# EAGLE design Codeshelf-0005.v1.r1 (EAGLE 5.11)
MFGN: Pansonic; MFGP: ERJ-2GEJ680X; MFN: Panasonic; NOTES: DNP; PRICE: 0.02
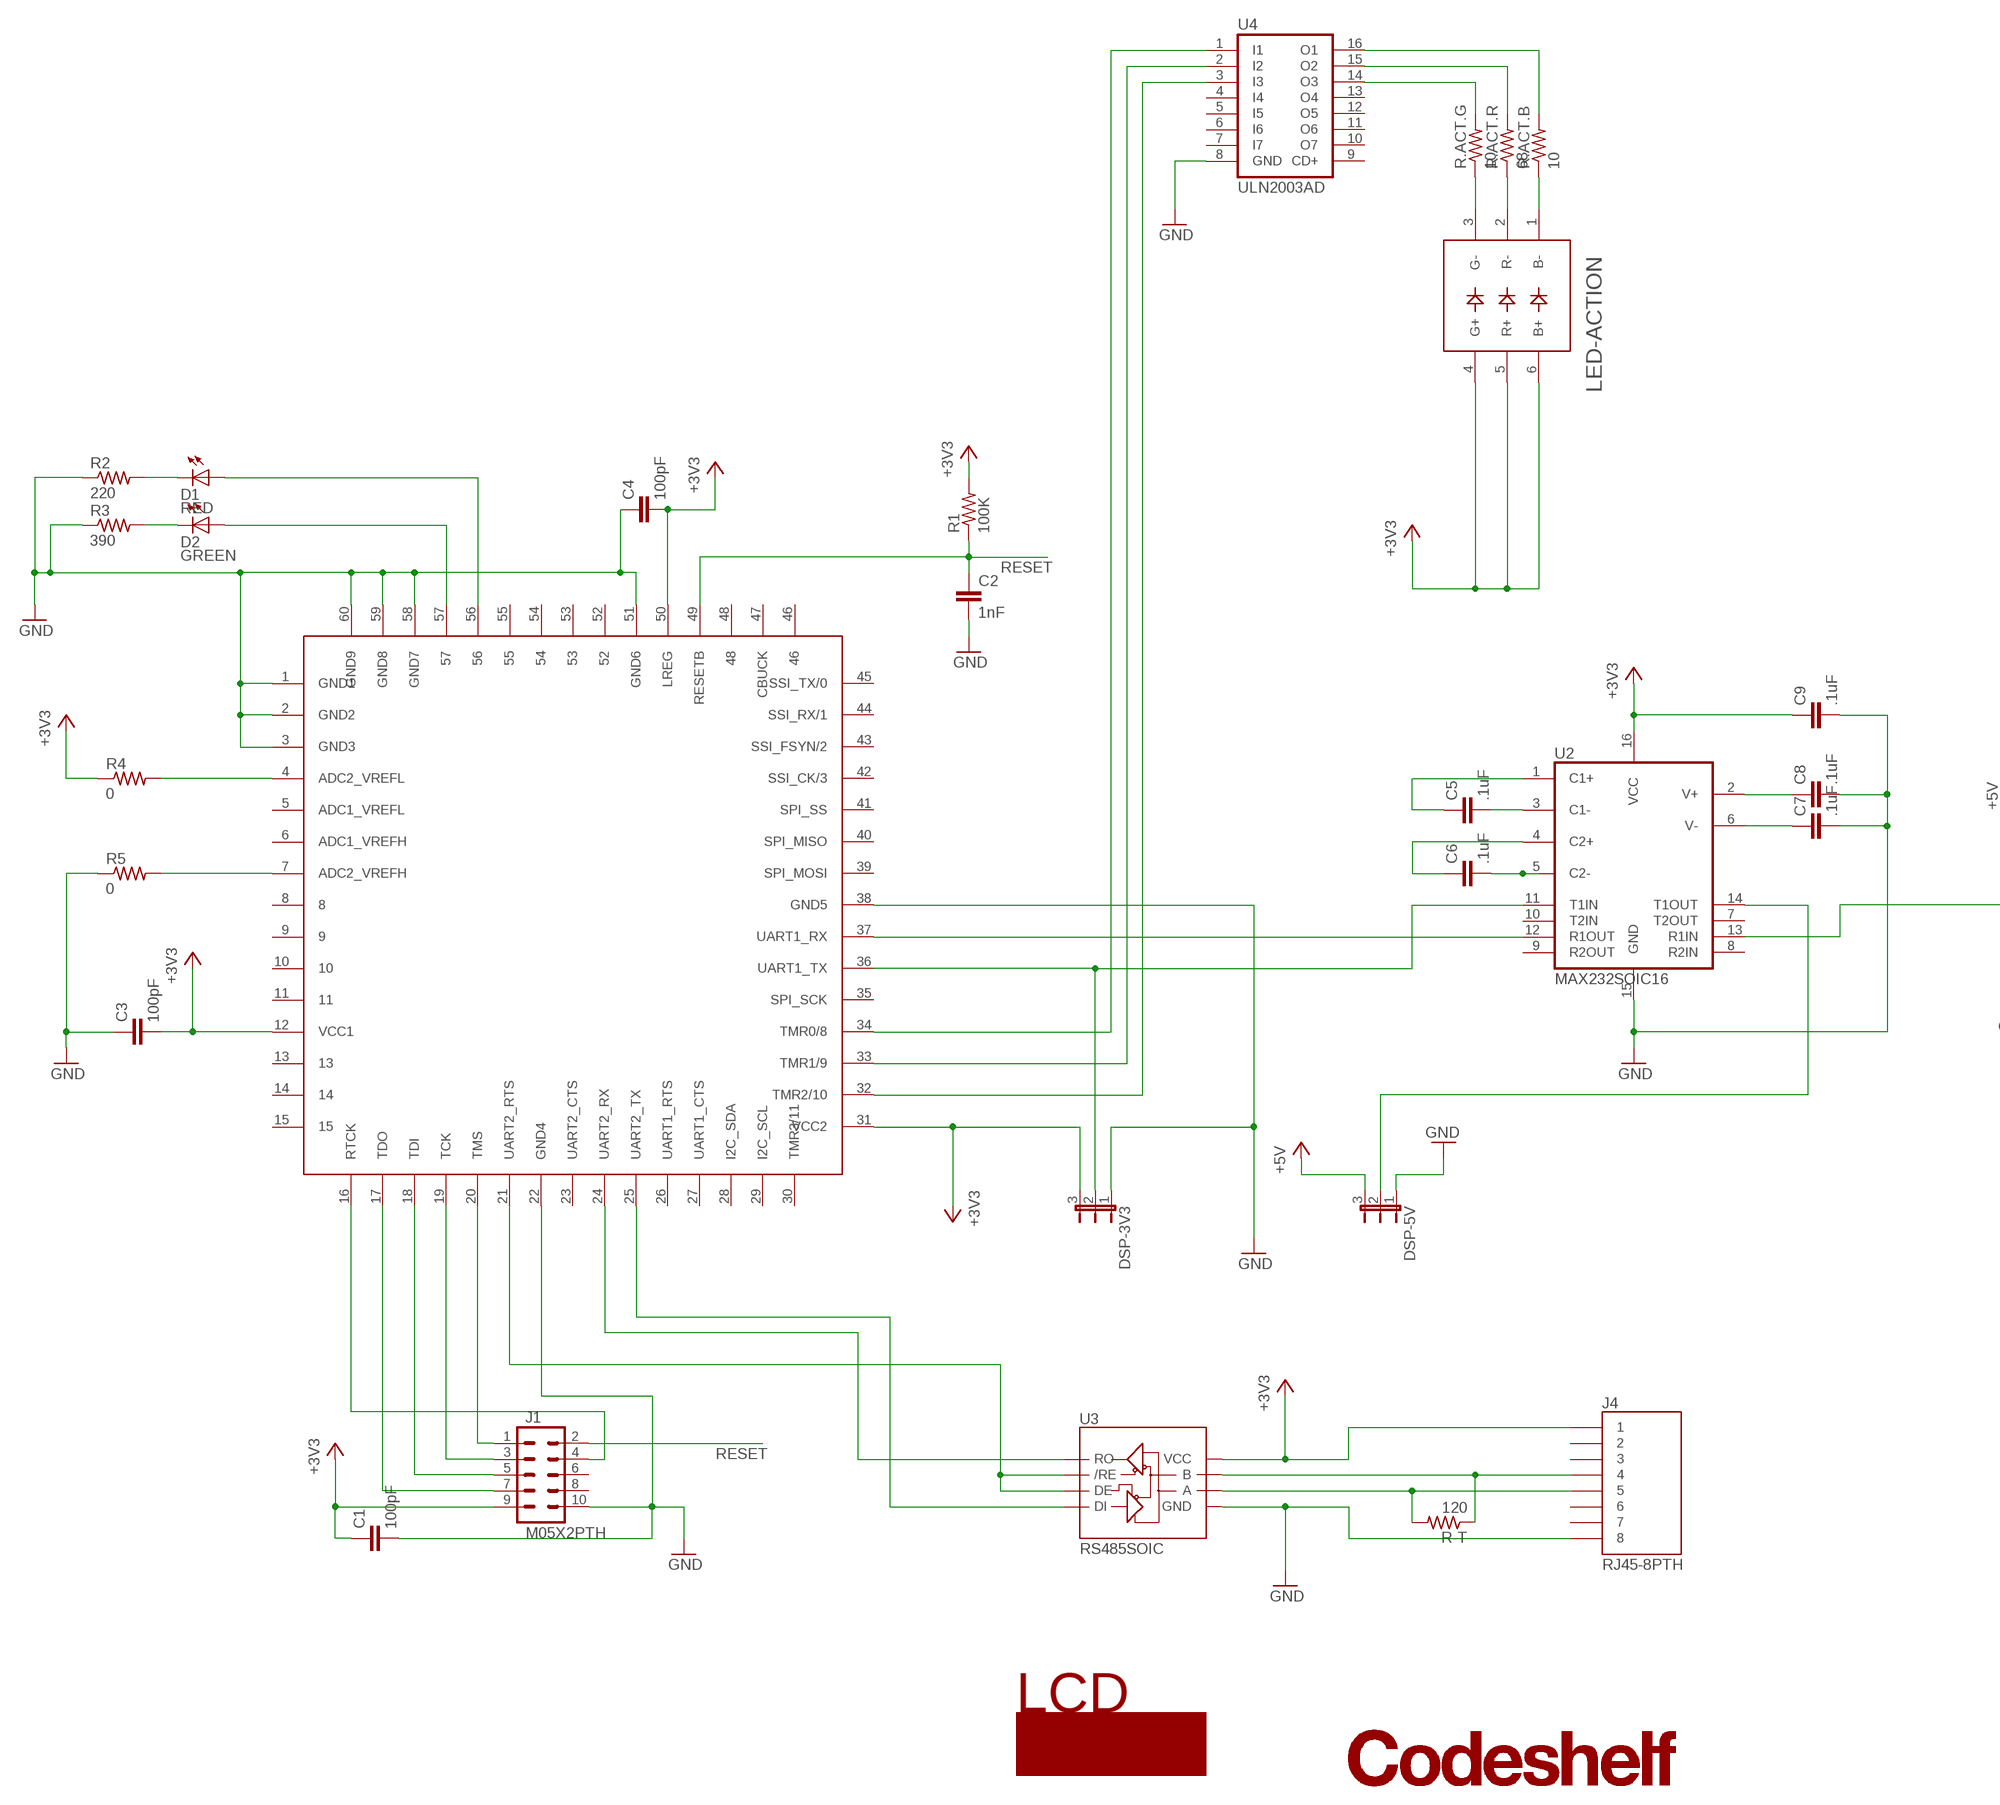
[diagram p0: schematic, sheet 1, part 1 of 2]
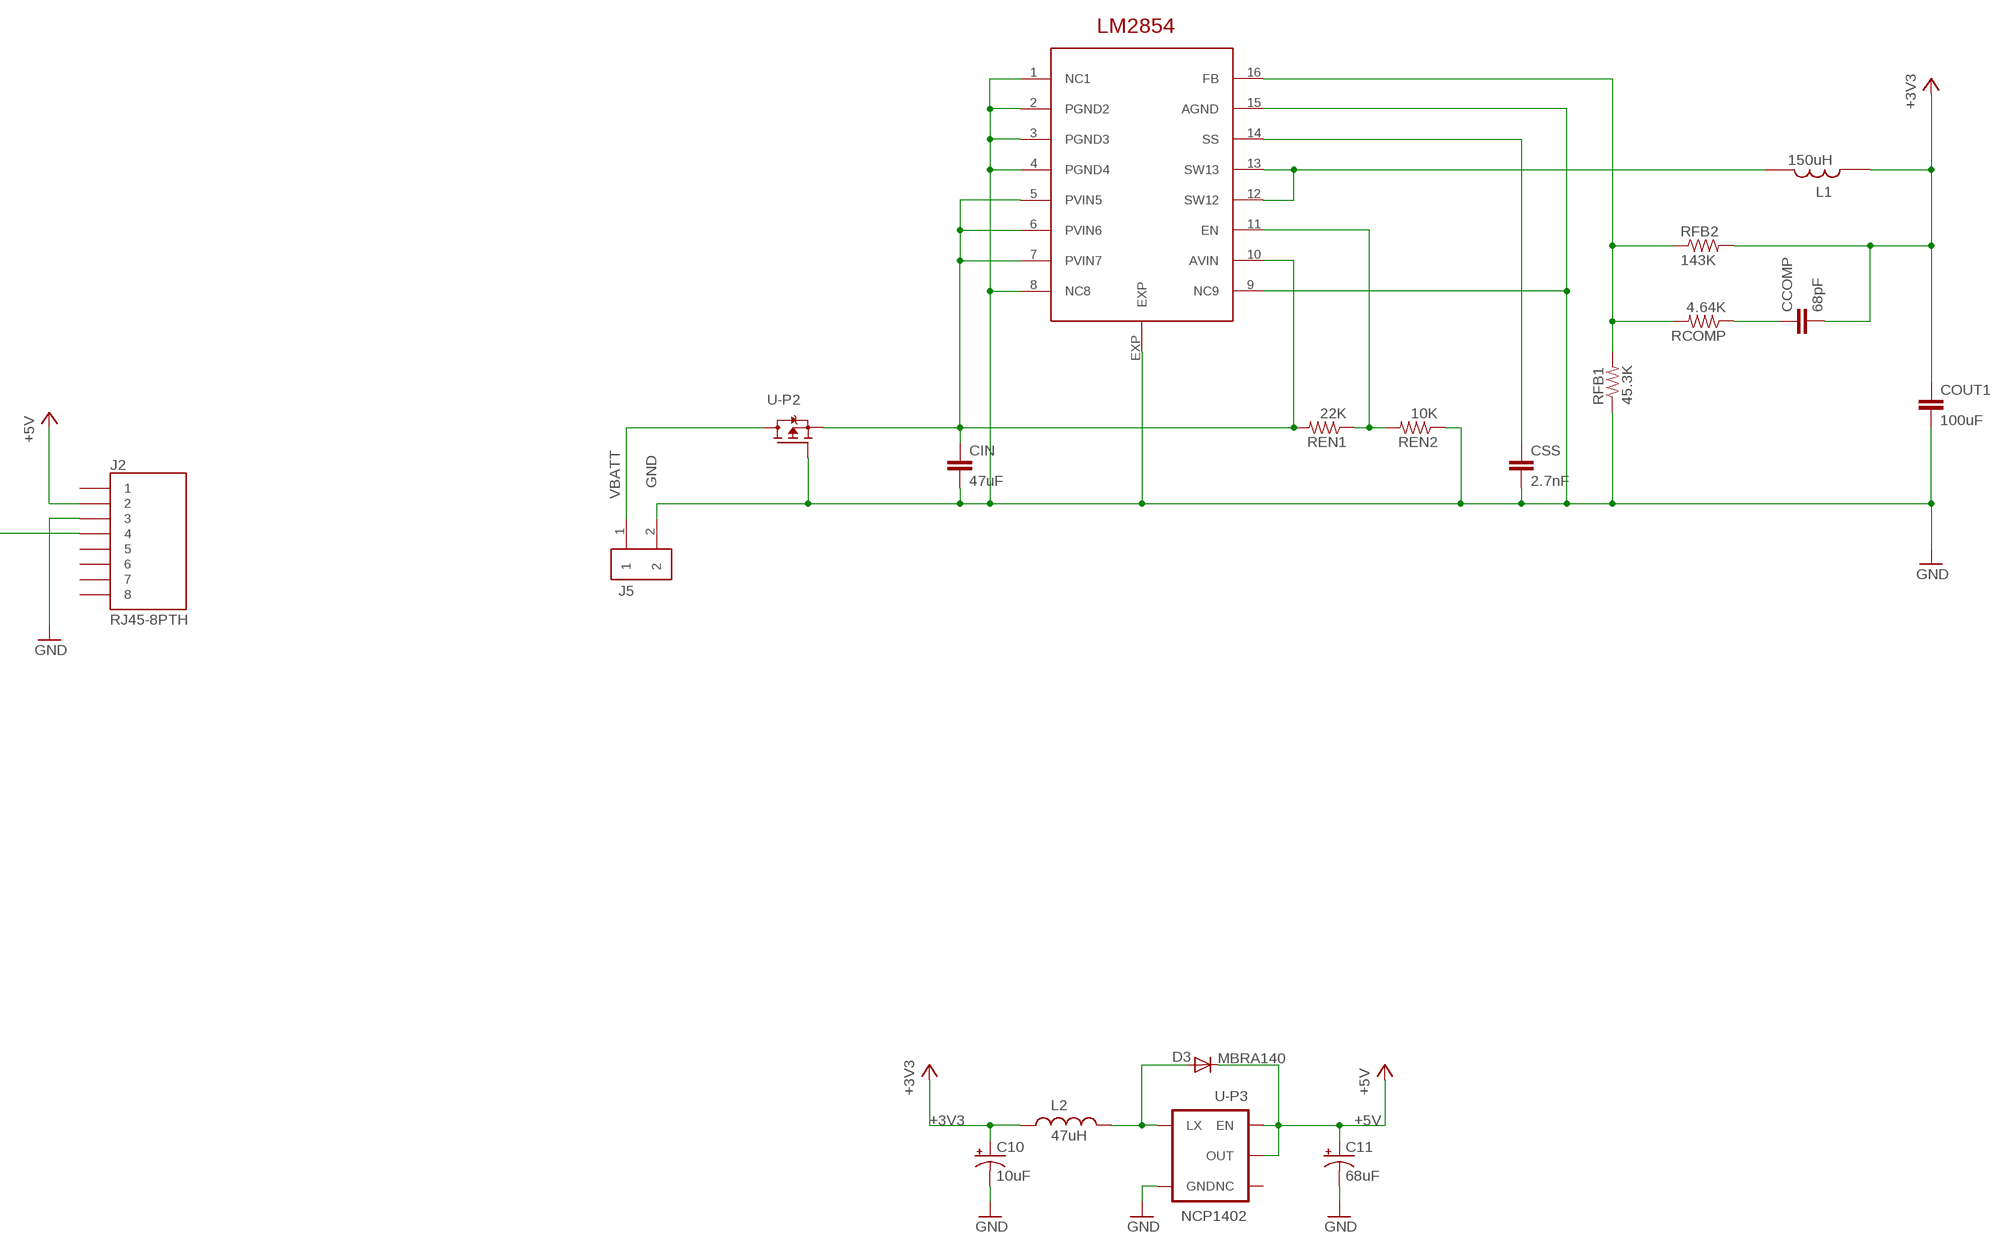
[diagram p1: schematic, sheet 1, part 2 of 2]

## Parts
C1  100pF  RF-C0603  [C0603]
C2  1nF  RF-C0603  [C0603]
C3  100pF  RF-C0603  [C0603]
C4  100pF  RF-C0603  [C0603]
C5  .1uF  RF-C0402  [C0402]
C6  .1uF  RF-C0402  [C0402]
C7  .1uF  RF-C0402  [C0402]
C8  .1uF  RF-C0402  [C0402]
C9  .1uF  RF-C0402  [C0402]
C10  10uF  CAP_POL1206  [EIA3216]
C11  68uF  CAP_POL3528  [EIA3528]
CCOMP  68pF  RF-C0402  [C0402]
CIN  47uF  RF-C1210  [C1210K]
COUT1  100uF  RF-C1210  [C1210K]
CSS  2.7nF  RF-C0805  [C0805]
D1  RED  LEDCHIP-LED0805  [CHIP-LED0805]
D2  GREEN  LEDCHIP-LED0805  [CHIP-LED0805]
D3  MBRA140  DIODESMA  [SMA-DIODE]
DSP-3V3  JUMPER-3PTH  [1X03]
DSP-5V  JUMPER-3PTH  [1X03]
J1  M05X2PTH  [AVR_ICSP]
J2  RJ45-8PTH  [RJ45-8]
J4  RJ45-8PTH  [RJ45-8]
J5  HEADER-2X39357-0002  [MOLEX-39357-0002]
L1  150uH  SLF10165  [SLF10165]
L2  47uH  INDUCTORCR54  [CR54]
LCD  LCD-SPARKFUN  LCD-SPARKFUN20X4  [LCD-20X4-SPARKFUN]
LED-ACTION  LED5060A  [PLCC-6]
LOGO  CODESHELF-LOGO  [CODESHELF-LOGO]
R1  100K  RF-R0402  [RF-R0402]
R2  220  RF-R0402  [RF-R0402]
R3  390  RF-R0402  [RF-R0402]
R4  0  RF-R0402  [RF-R0402]
R5  0  RF-R0402  [RF-R0402]
R-T  120  RF-R0402  [RF-R0402]
R.ACT.B  10  RF-R0402  [RF-R0402]
R.ACT.G  10  RF-R0402  [RF-R0402]
R.ACT.R  68  RF-R0402  [RF-R0402]
RCOMP  4.64K  RF-R0402  [RF-R0402]
REN1  22K  RF-R0402  [RF-R0402]
REN2  10K  RF-R0402  [RF-R0402]
RFB1  45.3K  RF-R0402  [RF-R0402]
RFB2  143K  RF-R0805  [RF-C0805]
U1  ZSFM201-1A  [ZSFM201-1]
U2  MAX232SOIC16  [SO016]
U3  RS485SOIC  [SO08]
U4  ULN2003AD  [SO16]
U-P1  LM2854MH  [HTSSOP16PWP]
U-P2  PCHANNEL-MOSFET-DPAK  [DPAK]
U-P3  NCP1402  V_REG_NCP1400SOT23-5  [SOT23-5]

## Nets
+3V3 [3v3]: C1.1 C3.2 C4.2 C9.1 C10.A(+) CCOMP.2 COUT1.1 DSP-3V3.3 J1.9 J4.1 L1.2 L2.P$1 LED-ACTION.4(G+) LED-ACTION.5(R+) LED-ACTION.6(B+) R1.2 R4.1 RFB2.2 U1.12(VCC1) U1.31(VCC2) U1.50(LREG) U2.16(VCC) U3.8(VCC)
+5V [5V]: C11.A(+) D3.C DSP-5V.3 J2.2 U-P3.1(EN) U-P3.2(OUT)
C1: C5.1 U2.1(C1+)
C2: C6.1 U2.4(C2+)
GND [GND]: C1.2 C2.2 C3.1 C4.1 C7.2 C8.2 C9.2 C10.C(-) C11.C(-) CIN.2 COUT1.2 CSS.2 DSP-3V3.1 DSP-5V.1 J1.10 J2.3 J4.8 J5.2 R2.1 R3.1 R5.1 REN2.1 RFB1.1 U1.1(GND1) U1.2(GND2) U1.3(GND3) U1.22(GND4) U1.38(GND5) U1.51(GND6) U1.58(GND7) U1.59(GND8) U1.60(GND9) U2.15(GND) U3.5(GND) U4.8(GND) U-P1.1(NC1) U-P1.2(PGND2) U-P1.3(PGND3) U-P1.4(PGND4) U-P1.8(NC8) U-P1.9(NC9) U-P1.15(AGND) U-P1.EXP U-P2.1(G) U-P3.4(GND)
N$1: D2.A U1.57
N$2: D1.A U1.56
N$3: D2.C R3.2
N$4: D1.C R2.2
N$5: D3.A L2.P$2 U-P3.5(LX)
N$6: R5.2 U1.7(ADC2_VREFH)
N$7: R4.2 U1.4(ADC2_VREFL)
N$8: C5.2 U2.3(C1-)
N$11: C6.2 U2.5(C2-)
N$12: C7.1 U2.6(V-)
N$15: C8.1 U2.2(V+)
N$17: U1.25(UART2_TX) U3.4(DI)
N$18: U1.24(UART2_RX) U3.1(RO)
N$19: U1.21(UART2_RTS) U3.2(/RE) U3.3(DE)
N$20 [RS485]: J4.4 R-T.1 U3.7(B)
N$21 [RS485]: J4.5 R-T.2 U3.6(A)
N$22: CSS.1 U-P1.14(SS)
N$23: L1.1 U-P1.12(SW12) U-P1.13(SW13)
N$24: RCOMP.2 RFB1.2 RFB2.1 U-P1.16(FB)
N$25: CCOMP.1 RCOMP.1
N$26: REN1.1 REN2.2 U-P1.11(EN)
N$28: R.ACT.R.2 U4.15(O2)
N$30: R.ACT.G.2 U4.14(O3)
N$33: LED-ACTION.1(B-) R.ACT.B.1
N$34: LED-ACTION.2(R-) R.ACT.R.1
N$35: LED-ACTION.3(G-) R.ACT.G.1
N$36: U1.34(TMR0/8) U4.1(I1)
N$37: U1.33(TMR1/9) U4.2(I2)
N$38: R.ACT.B.2 U4.16(O1)
N$39: U1.32(TMR2/10) U4.3(I3)
R1IN: J2.4 U2.13(R1IN)
R1OUT: U1.37(UART1_RX) U2.12(R1OUT)
RESET: C2.1 J1.2 R1.1 U1.49(RESETB)
RTCK: J1.4 U1.16(RTCK)
T1IN: DSP-3V3.2 U1.36(UART1_TX) U2.11(T1IN)
T1OUT: DSP-5V.2 U2.14(T1OUT)
TCK: J1.3 U1.19(TCK)
TDI: J1.5 U1.18(TDI)
TDO: J1.7 U1.17(TDO)
TMS: J1.1 U1.20(TMS)
V-PROT: CIN.1 REN1.2 U-P1.5(PVIN5) U-P1.6(PVIN6) U-P1.7(PVIN7) U-P1.10(AVIN) U-P2.3(S)
VBATT: J5.1 U-P2.4(D)
Unconnected: J1.6 J1.8 J2.1 J2.5 J2.6 J2.7 J2.8 J4.2 J4.3 J4.6 J4.7 U1.5(ADC1_VREFL) U1.6(ADC1_VREFH) U1.8 U1.9 U1.10 U1.11 U1.13 U1.14 U1.15 U1.23(UART2_CTS) U1.26(UART1_RTS) U1.27(UART1_CTS) U1.28(I2C_SDA) U1.29(I2C_SCL) U1.30(TMR3/11) U1.35(SPI_SCK) U1.39(SPI_MOSI) U1.40(SPI_MISO) U1.41(SPI_SS) U1.42(SSI_CK/3) U1.43(SSI_FSYN/2) U1.44(SSI_RX/1) U1.45(SSI_TX/0) U1.46 U1.47(CBUCK) U1.48 U1.52 U1.53 U1.54 U1.55 U2.7(T2OUT) U2.8(R2IN) U2.9(R2OUT) U2.10(T2IN) U4.4(I4) U4.5(I5) U4.6(I6) U4.7(I7) U4.9(CD+) U4.10(O7) U4.11(O6) U4.12(O5) U4.13(O4) U-P3.3(NC)

## Library data of the parts
C1-C9 CCOMP CIN COUT1 CSS = GW-devices:RF-C: RF capacitor pads for FSL reference design
C10 C11 = SparkFun:CAP_POL: Capacitor Polarized These are standard SMD and PTH capacitors. Normally 10uF, 47uF, and 100uF in electrolytic and tantalum varieties. Always verify the external diameter of the through hole cap, it varies with capacity, voltage, and manufacturer. The EIA devices should be standard.
D1 D2 = led:LED: LED OSRAM: - CHIPLED LG R971, LG N971, LY N971, LG Q971, LY Q971, LO R971, LY R971 LH N974, LH R974 LS Q976, LO Q976, LY Q976 LO Q996 - Hyper CHIPLED LW Q18S LB Q993, LB Q99A, LB R99A - SideLED LS A670, LO A670, LY A670, LG A670, LP A670 LB A673, LV A673, LT A673, LW A673 LH A674 LY A675 LS A676, LA A676, LO A676, LY A676, LW A676 LS A679, LY A679, LG A679 - Hyper Micro SIDELED® LS Y876, LA Y876, LO Y876, LY Y876 LT Y87S - SmartLED LW L88C, LW L88S LB L89C, LB L89S, LG L890 LS L89K, LO L89K, LY L89K LS L896, LA L896, LO L896, LY L896 - TOPLED LS T670, LO T670, LY T670, LG T670, LP T670 LSG T670, LSP T670, LSY T670, LOP T670, LYG T670 LG T671, LOG T671, LSG T671 LB T673, LV T673, LT T673, LW T673 LH T674 LS T676, LA T676, LO T676, LY T676, LB T676, LH T676, LSB T676, LW T676 LB T67C, LV T67C, LT T67C, LS T67K, LO T67K, LY T67K, LW E67C LS E67B, LA E67B, LO E67B, LY E67B, LB E67C, LV E67C, LT E67C LW T67C LS T679, LY T679, LG T679 LS T770, LO T770, LY T770, LG T770, LP T770 LB T773, LV T773, LT T773, LW T773 LH T774 LS E675, LA E675, LY E675, LS T675 LS T776, LA T776, LO T776, LY T776, LB T776 LHGB T686 LT T68C, LB T68C - Hyper Mini TOPLED® LB M676 - Mini TOPLED Santana® LG M470 LS M47K, LO M47K, LY M47K Source: http://www.osram.convergy.de LUXEON: - LUMILED® LXK2-PW12-R00, LXK2-PW12-S00, LXK2-PW14-U00, LXK2-PW14-V00 LXK2-PM12-R00, LXK2-PM12-S00, LXK2-PM14-U00 LXK2-PE12-Q00, LXK2-PE12-R00, LXK2-PE12-S00, LXK2-PE14-T00, LXK2-PE14-U00 LXK2-PB12-K00, LXK2-PB12-L00, LXK2-PB12-M00, LXK2-PB14-N00, LXK2-PB14-P00, LXK2-PB14-Q00 LXK2-PR12-L00, LXK2-PR12-M00, LXK2-PR14-Q00, LXK2-PR14-R00 LXK2-PD12-Q00, LXK2-PD12-R00, LXK2-PD12-S00 LXK2-PH12-R00, LXK2-PH12-S00 LXK2-PL12-P00, LXK2-PL12-Q00, LXK2-PL12-R00 Source: www.luxeon.com KINGBRIGHT: KA-3528ASYC Source: www.kingbright.com
D3 = SparkFun:DIODE: Diode These are standard reverse protection diodes and small signal diodes. SMA package can handle up to about 1A. SOD-323 can handle about 200mA. What the SOD-323 package when ordering, there are some mfgs out there that are 5-pin packages.
DSP-3V3 DSP-5V = SparkFun:JUMPER-3
J1 = SparkFun:M05X2: Header 5x2 Standard 10-pin dual row 0.1" header. Commonly used with AVR-ISP. Use with Spark Fun Electronics SKU: PRT-00778
J2 J4 = SparkFun:RJ45-8: RJ45 Jack Simple RJ45, 8-pin connection - connector for common Cat5, Cat5e, and Cat6 Ethernet cables. Footprint not yet proven in production. Connector sku is PRT-00643; Breakout PCB sku is BOB-00716.
J5 = GW-devices:HEADER-2X: 2 position pin header
L1 = GW-devices:SLF10165
L2 = SparkFun:INDUCTOR: Inductors Basic Inductor/Choke - 0603 and 1206. Footprints are not proven and vary greatly between part numbers.
LCD = GW-devices:LCD-SPARKFUN
LED-ACTION = GW-devices:LED5060: PLCC-6 5060 6000mcd RGB LED; PRICE: 0.25
LOGO = GW-devices:CODESHELF-LOGO
R1-R5 R-T R.ACT.B R.ACT.G R.ACT.R RCOMP REN1 REN2 RFB1 RFB2 = GW-devices:RF-R: RF resistor pads for FSL reference design
U1 = GW-devices:ZSFM201-1: The CEL MC13224V
U2 = SparkFun:MAX232: RS232 Transceiver Very common IC. This is generically called 'MAX232', but works with the 3V equivalent MAX3232 generic ICs. Field tested and mother approved. Spark Fun Electronics SKU : COM-00316 (DIP) and COM-00589 (SMD)
U3 = SparkFun:RS485
U4 = uln-udn:ULN2003A: DRIVER ARRAY
U-P1 = GW-devices:LM2854
U-P2 = GW-devices:PCHANNEL-MOSFET
U-P3 = SparkFun:V_REG_NCP1400: Switching step-up voltage regulator NCP1400 switiching regulator takes single cell AA and outputs 100mA at 3.3V or 5V with minimal number of external components.

## Net classes
1 3v3: width 0.6 mm
2 5V: width 0.6 mm
3 +3V3: width 0.6 mm
4 GND: width 0.6 mm
5 RS485: width 0.4 mm

## Board
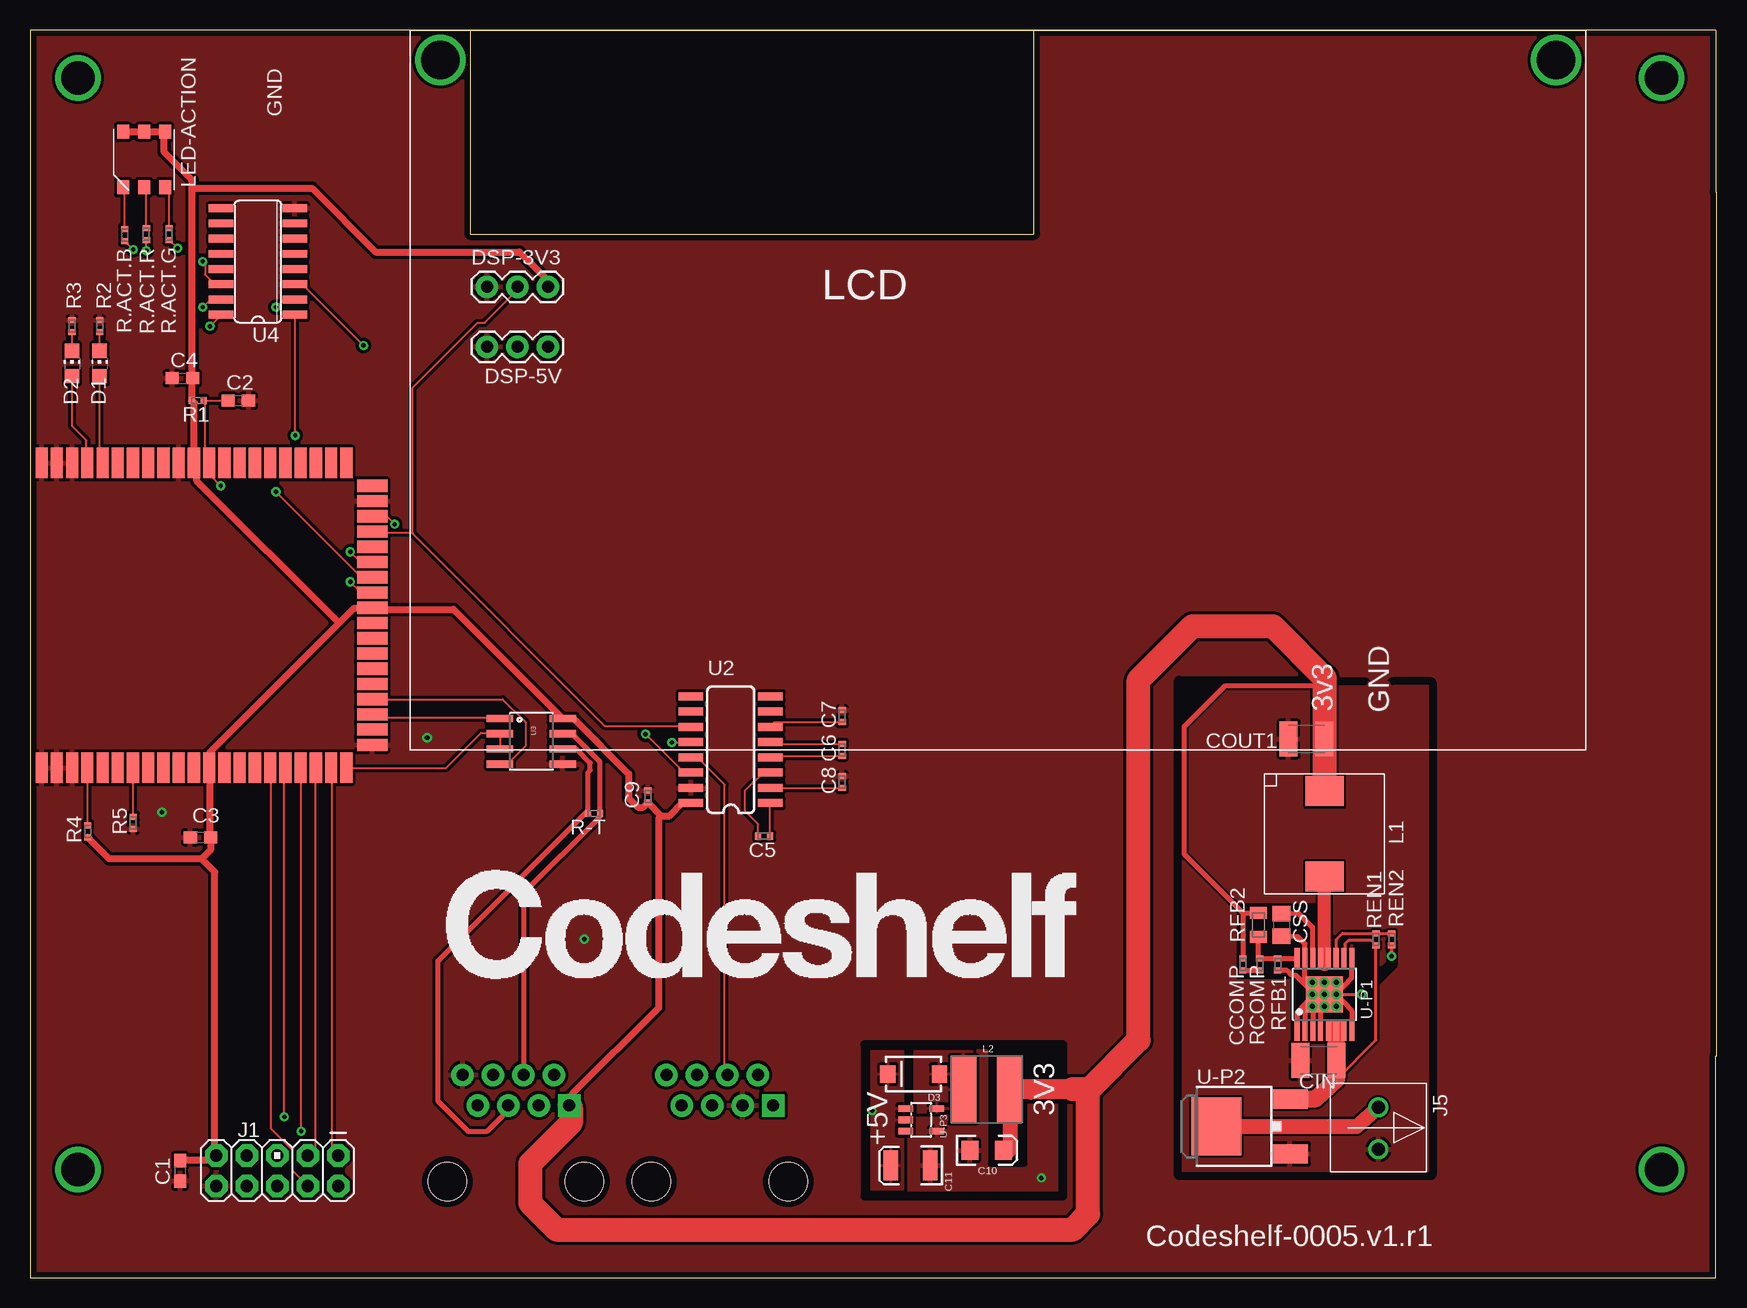
[diagram p2: board, top side]
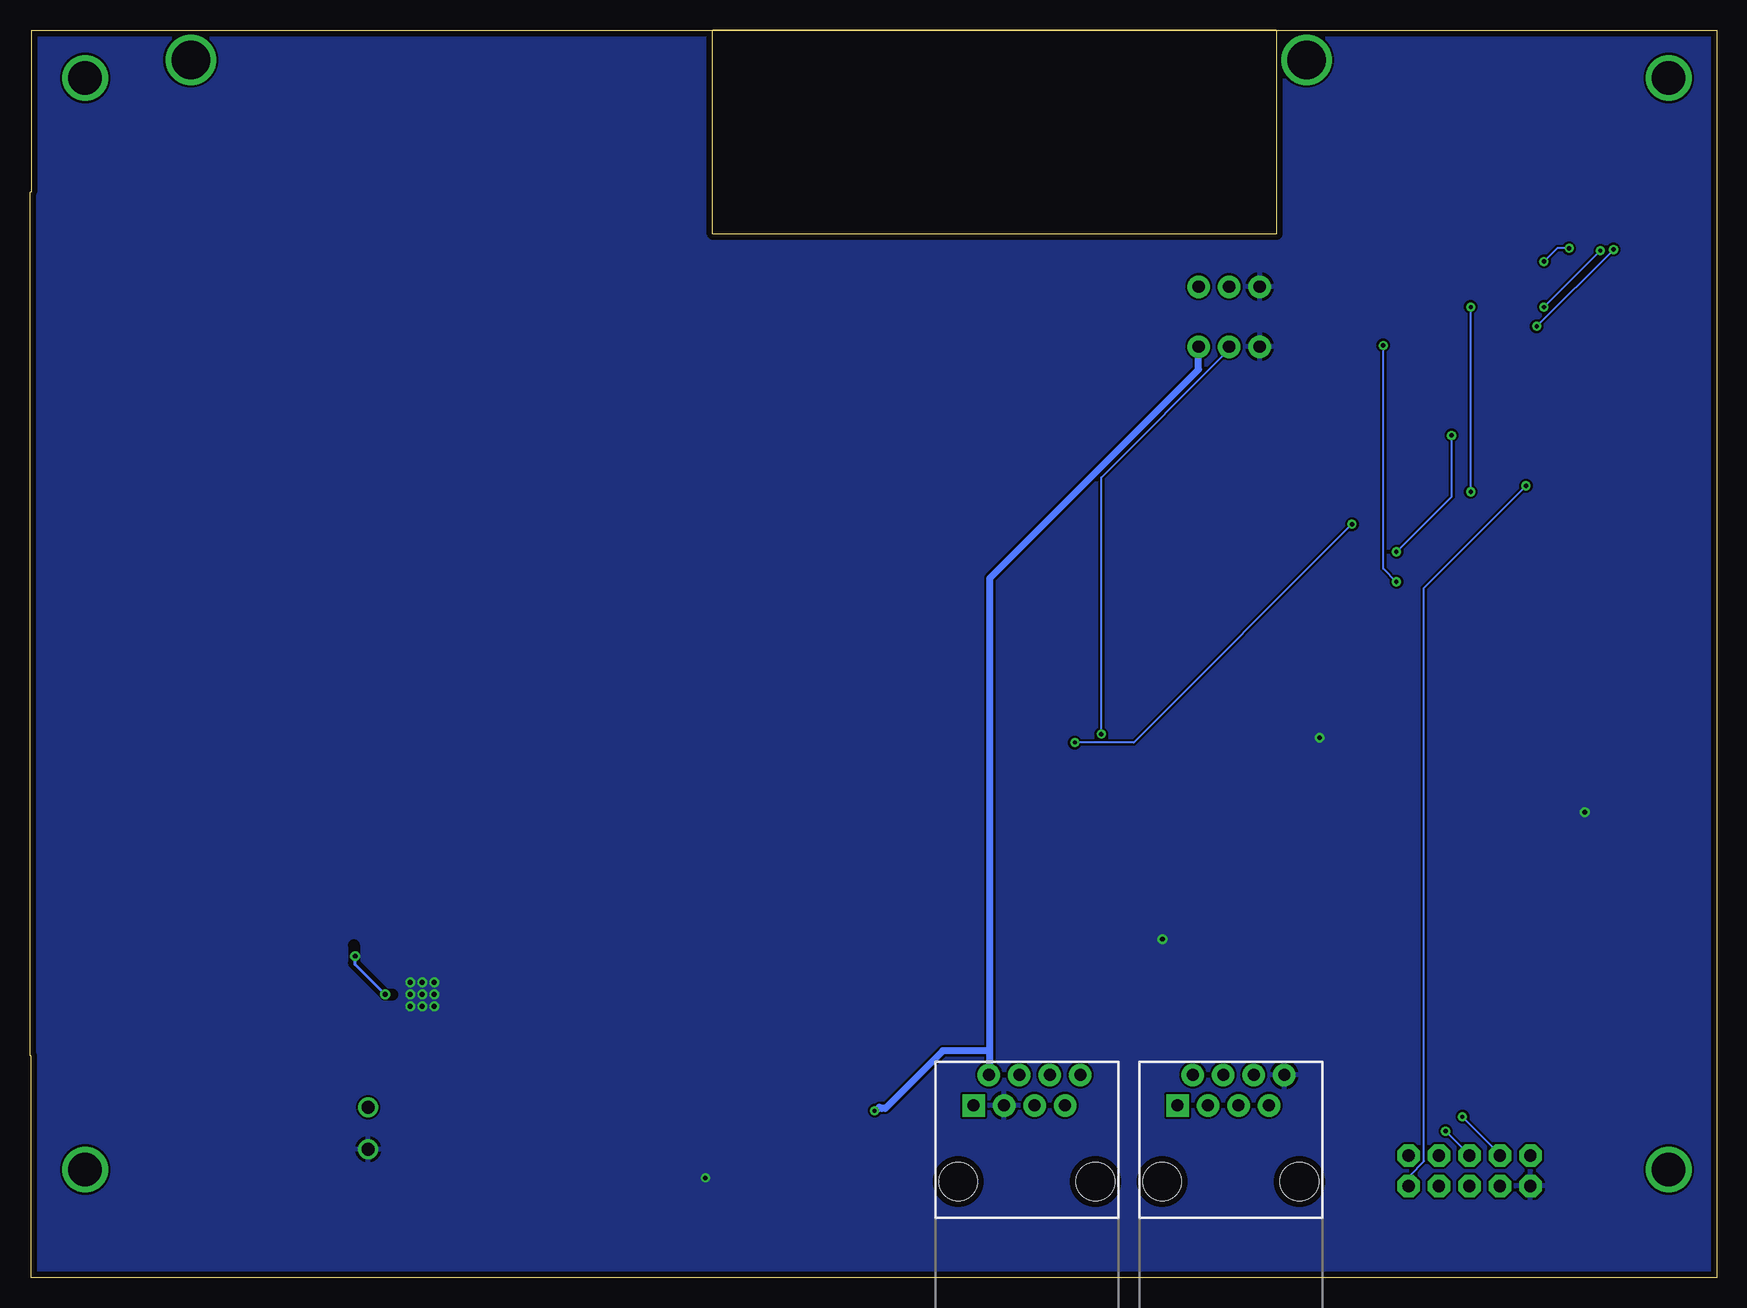
[diagram p3: board, bottom side, seen from below]

Size 140.6 x 104 mm. Coordinates in mm from the lower left corner, seen from the top.
Outline: 0,0 140.5,0 140.5,18.5 140.6,18.5 140.6,90.5 140.5,90.5 140.5,104 0,104 0,0
Copper layers (1*16): Top 0.0356mm / dielectric 1.5011mm / Bottom 0.0356mm
Design rules "SilverCircuits": minimum track width 7mil, minimum drill 14mil, track to track 7mil, track to pad 7mil, pad to pad 7mil, via to via 7mil, smd to smd 0mil, copper to edge 20mil, drill to drill 8mil, minimum pad ring 10mil, minimum via ring 8mil, stop-mask expansion 4mil, vias tented up to drill 0mil, thermal gap 10mil
tRestrict: area -9.5,38.1 to -0.1,72.3; area 105.4,19.5 to 107.9,21.4; area 109.9,19.5 to 110.6,21.6; area 109.9,25.6 to 110.6,27.5; area 106,25.6 to 106.6,27.7; area 105.1,19.5 to 105.8,26.2; area 105.3,21.5 to 110.5,26.1; area 100.6,24.9 to 107.4,31.2; area 106.2,39.1 to 109.7,41.9; area 80.1,9.5 to 82.9,19.1; 24 lines
bRestrict: area -9.5,38.1 to -0.1,72.3; 3 lines

### Footprints (pad centres in the part's own frame; a part is rotated, then mirrored left to right if it is on the bottom)
C0603 = smd 1.1 x 1: 1 -0.85,0; 2 0.85,0
C0402 = smd 0.5 x 0.6: 1 -0.5,0; 2 0.5,0
EIA3216 = smd 1.4 x 1.6: A 1.4,0; C -1.4,0
EIA3528 = smd 1.2 x 2.5: A 1.65,0; C -1.65,0
C1210K = smd 1.5 x 2.9: 1 -1.5,0; 2 1.5,0
C0805 = smd 1.3 x 1.5: 1 -0.95,0; 2 0.95,0
CHIP-LED0805 = smd 1.2 x 1.2: A 0,-1.05; C 0,1.05
SMA-DIODE = smd 1.27 x 1.47: A -2.15,0; C 2.15,0
1X03 = drill 1.016 pad 1.88: 1 0,0; 2 2.54,0; 3 5.08,0
AVR_ICSP = drill 1.016 pad 1.88 octagon: 1 -1.27,5.08; 2 1.27,5.08; 3 -1.27,2.54; 4 1.27,2.54; 5 -1.27,0; 6 1.27,0; 7 -1.27,-2.54; 8 1.27,-2.54; 9 -1.27,-5.08; 10 1.27,-5.08
RJ45-8 = drill 1 pad 1.88 square: 1 -4.445,6.35 | drill 1 pad 1.88: 2 -3.175,8.89; 3 -1.905,6.35; 4 -0.635,8.89; 5 0.635,6.35; 6 1.905,8.89; 7 3.175,6.35; 8 4.445,8.89 | hole 3.2: -5.715,0; 5.715,0
MOLEX-39357-0002 = drill 1.1: 1 -1.7,0; 2 1.8,0
SLF10165 = smd 2.5 x 3.2: 1 -3.55,0; 2 3.55,0
CR54 = smd 5.5 x 2.15: P$1 0,1.92; P$2 0,-1.92
LCD-20X4-SPARKFUN = drill 3.2: P$1 -37.5,15.5; P$4 55.5,15.5
PLCC-6 = smd 1.18 x 1: 1 -2.31,1.75; 2 -2.31,0; 3 -2.31,-1.75; 4 2.31,-1.75; 5 2.31,0; 6 2.31,1.75
RF-R0402 = smd 0.5 x 0.6: 1 -0.5,0; 2 0.5,0
RF-C0805 = smd 1 x 1.4: 1 -1,0; 2 1,0
ZSFM201-1 = smd 2.54 x 1.016: 1 -12.7,28.829; 2 -12.7,27.559; 3 -12.7,26.289; 4 -12.7,25.019; 5 -12.7,23.749; 6 -12.7,22.479; 7 -12.7,21.209; 8 -12.7,19.939; 9 -12.7,18.669; 10 -12.7,17.399; 11 -12.7,16.129; 12 -12.7,14.859; 13 -12.7,13.589; 14 -12.7,12.319; 15 -12.7,11.049; 16 -12.7,9.779; 17 -12.7,8.509; 18 -12.7,7.239; 19 -12.7,5.969; 20 -12.7,4.699; 21 -12.7,3.429; 40 12.7,3.429; 41 12.7,4.699; 42 12.7,5.969; 43 12.7,7.239; 44 12.7,8.509; 45 12.7,9.779; 46 12.7,11.049; 47 12.7,12.319; 48 12.7,13.589; 49 12.7,14.859; 50 12.7,16.129; 51 12.7,17.399; 52 12.7,18.669; 53 12.7,19.939; 54 12.7,21.209; 55 12.7,22.479; 56 12.7,23.749; 57 12.7,25.019; 58 12.7,26.289; 59 12.7,27.559; 60 12.7,28.829 | smd 1.016 x 2.54: 22 -10.795,1.27; 23 -9.525,1.27; 24 -8.255,1.27; 25 -6.985,1.27; 26 -5.715,1.27; 27 -4.445,1.27; 28 -3.175,1.27; 29 -1.905,1.27; 30 -0.635,1.27; 31 0.635,1.27; 32 1.905,1.27; 33 3.175,1.27; 34 4.445,1.27; 35 5.715,1.27; 36 6.985,1.27; 37 8.255,1.27; 38 9.525,1.27; 39 10.795,1.27
SO016 = smd 0.66 x 2.032: 1 -4.445,-3.315; 2 -3.175,-3.315; 3 -1.905,-3.315; 4 -0.635,-3.315; 5 0.635,-3.315; 6 1.905,-3.315; 7 3.175,-3.315; 8 4.445,-3.315; 9 4.445,3.315; 10 3.175,3.315; 11 1.905,3.315; 12 0.635,3.315; 13 -0.635,3.315; 14 -1.905,3.315; 15 -3.175,3.315; 16 -4.445,3.315
SO08 = smd 0.61 x 2.21: 1 -1.905,-2.616; 2 -0.635,-2.616; 3 0.635,-2.616; 4 1.905,-2.616; 5 1.905,2.616; 6 0.635,2.616; 7 -0.635,2.616; 8 -1.905,2.616
SO16 = smd 0.66 x 2.032: 1 -4.445,-3.073; 2 -3.175,-3.073; 3 -1.905,-3.073; 4 -0.635,-3.073; 5 0.635,-3.073; 6 1.905,-3.073; 7 3.175,-3.073; 8 4.445,-3.073; 9 4.445,3.073; 10 3.175,3.073; 11 1.905,3.073; 12 0.635,3.073; 13 -0.635,3.073; 14 -1.905,3.073; 15 -3.175,3.073; 16 -4.445,3.073
HTSSOP16PWP = smd 0.42 x 1.78: 1 -2.275,-2.975; 2 -1.625,-2.975; 3 -0.975,-2.975; 4 -0.325,-2.975; 5 0.325,-2.975; 6 0.975,-2.975; 7 1.625,-2.975; 8 2.275,-2.975; 9 2.275,2.975; 10 1.625,2.975; 11 0.975,2.975; 12 0.325,2.975; 13 -0.325,2.975; 14 -0.975,2.975; 15 -1.625,2.975; 16 -2.275,2.975 | smd 3.1 x 3: EXP 0,0
DPAK = smd 1.6 x 3: 1 -2.28,-4.04; 3 2.28,-4.04 | smd 4.826 x 4.191: 4 0,2.096
SOT23-5 = smd 0.55 x 1.2: 1 -0.95,-1.3; 2 0,-1.3; 3 0.95,-1.3; 4 0.95,1.3; 5 -0.95,1.3

### Placement (x,y rotation side)
C1  12.5,8.9 270 top
C2  17.36,73.1 0 top
C3  14.22,36.7 0 top
C4  12.7,74.96 0 top
C5  61.2,36.8 180 top
C6  67.7,44 90 top
C7  67.7,46.8 90 top
C8  67.7,41.3 90 top
C9  51.5,40.1 90 top
C10  79.75,10.61 0 top
C11  73.4,9.34 180 top
CCOMP  101.1,26.1 90 top
CIN  107.4,18.1 180 top
COUT1  106.4,44.9 180 top
CSS  104.3,29.4 270 top
D1  5.8,76.2 0 top
D2  3.5,76.2 0 top
D3  73.65,16.96 180 top
DSP-3V3  38.1,82.6 0 top
DSP-5V  38.1,77.6 0 top
J1  20.61,8.9 270 top
J2  57.5,8 0 bottom
J4  40.5,8 0 bottom
J5  112.4,12.5 270 top
L1  107.9,37 90 top
L2  79.75,15.69 270 top
LCD  71.7,86 0 top
LED-ACTION  9.5,93.2 90 top
LOGO  59.44,27.74 0 top
R1  13.96,73.1 180 top
R2  5.8,79.3 270 top
R3  3.5,79.3 270 top
R4  4.8,37.2 90 top
R5  8.6,37.9 90 top
R-T  47,38.7 180 top
R.ACT.B  7.9,86.9 270 top
R.ACT.G  11.6,87 270 top
R.ACT.R  9.7,87 270 top
RCOMP  102.5,26.1 90 top
REN1  112.2,28.2 270 top
REN2  113.5,28.2 90 top
RFB1  104,26.1 90 top
RFB2  102.4,29.4 90 top
U1  29.8,55.2 90 top
U2  58.4,44 90 top
U3  41.8,44.7 270 top
U4  19,84.7 90 top
U-P1  107.9,23.6 0 top
U-P2  101,12.6 90 top
U-P3  74.29,13.15 270 top

### Tracks (layer width: path | path; a pad name or v marks a point on that pad's centre or on a via)
+3V3
  Top 0.4: CCOMP.2 101.1,30.4 96.2,35.3 96.2,45.9 99.6,49.3 107.8,49.3 107.9,49.2
  Top 0.406: 107.9,50 107.3,49.7 | 101.1,30.4 RFB2.2 | L2.P$1 84,15.69 84,15.7
  Top 0.6: L1.2 107.1,40.3 | 83.4,15.7 83.4,15.1 | 107.9,50 107.4,50.4 | 87.5,16.4 87.33,16.11 87.1,15.7 | LED-ACTION.6 7.8,95.5 LED-ACTION.5 9.7,95.5 11.2,95.5 LED-ACTION.4 11.2,95.2 11.2,93.8 13.5,91.5 13.5,90.8 | 13.5,90.8 13.5,75.2 C4.2 13.5,74.9 13.5,73.1 R1.2 13.7,72.9 13.7,67.9 U1.50 13.9,67.7 13.9,66.4 25.75,54.55 | DSP-3V3.3 43.1,82.6 43.1,83.2 40.8,85.5 28.8,85.5 23.5,90.8 13.5,90.8 | 52.6,38.5 C9.1 51.1,39.2 50.7,39.2 49.9,40 49.9,42 45.3,46.6 44.5,46.6 U3.8 44.2,46.8 35.3,55.7 28.8,55.7 U1.31 28.5,55.8 27,55.8 25.75,54.55 | 52.6,38.5 53.3,38.5 54.4,39.6 55,39.6 U2.16 | C1.1 12.5,9.8 15.2,9.8 15.5,10.1 J1.9 15.4,10.4 15.4,33.8 14.3,34.9 | R4.1 6.6,34.9 14.3,34.9 | 14.3,34.9 15.1,35.7 15.1,36.7 C3.2 15,36.9 15,42.5 U1.12 15,42.7 15,43.8 25.75,54.55 | J4.1 45.2,15.3 52.4,22.5 52.4,38.3 52.6,38.5
  Top 1.27: 107.8,49.3 107.9,49.3 | C10.A 81.67,10.61 L2.P$1
  Top 1.676: L1.2 COUT1.1 107.9,49.2 107.9,50 | 81.7,15.7 83.4,15.7 84,15.7 86.9,15.7 87.1,15.7
  Top 2: 88.3,15.7 92.4,19.8 92.4,49.8 96.9,54.3 103.6,54.3 107.9,50 107.9,40.5 | 88.3,15.7 86.9,15.7 | 88.3,15.7 88.2,15.6 88.2,5.3 86.9,4 43.9,4 41.7,6.2 41.7,9.5 45.1,12.9 45.1,14.2 J4.1
+5V  (via drill 0.36)
  Bottom 0.6: v70.2,13.9 70.1,13.9 69.8,14.2 69.6,14.1 69.3,14.1 64.5,18.9 60.6,18.9 | 60.6,18.9 60.6,16.9 J2.2 | 60.6,18.9 60.6,58.3 43.2,75.7 43.2,77.6 DSP-5V.3
  pour Top (isolate 0.305): 69.59,19.5 69.59,6.8 72.77,6.8 72.77,19.5
C1
  Top 0.178: C5.1 61.7,39.5 U2.1
C2
  Top 0.178: C6.1 61.9,43.5 61.8,43.4 U2.4
GND  (via drill 0.36, 0.4)
  Top 0.25: v113.5,26.8 REN2.1 | v111,23.6 v108.9,23.6 U-P1.EXP
  Top 0.254: 106.92,22.6 v106.9,22.6 | v108.9,22.6 v107.9,22.6 U-P1.EXP | U-P1.EXP v107.9,24.6 | v107.9,24.6 v108.9,23.6 | v107.9,24.6 v108.9,24.6 | v107.9,24.6 v106.9,24.6 | U-P1.EXP v106.9,23.6 | U-P1.EXP 107.42,23.6 106.92,23.1
  Top 0.4: 106.28,26.3 106.28,27.82 105.7,28.4 CSS.2 | v106.9,23.6 106.9,23.8 | RFB1.1 104.8,25.6 105.2,25.2 105.5,25.2 106.28,24.43
  Top 0.406: U-P1.1 105.62,22.12 106.28,22.77 | 106.28,22.77 U-P1.2 | 106.28,22.77 106.92,23.43 | 106.92,23.43 106.92,23.1 106.92,22.6 U-P1.3 | 106.92,23.43 107.1,23.6 106.28,24.43 106.28,26.3 U-P1.15 | U-P1.4 107.58,23.27 U-P1.EXP | U-P1.8 110.17,22.23 v108.9,23.6 110.17,24.98 U-P1.9
  Bottom 0.25: v113.5,26.8 113.5,26.1 v111,23.6
  other vias: 107.9,23.6 84.3,8.3 11,38.8 33.1,45 46.2,28.2
  pour Top (isolate 0.305): 73.78,6.8 73.78,12.39 85.85,12.39 85.85,6.8
  pour Bottom (isolate 0.305): 86.1,6.8 69.59,6.8 69.59,19.5 86.1,19.5
  pour Bottom: 95.8,8.6 95.8,49.6 116.9,49.6 116.9,8.6
  pour Top: 95.8,8.6 95.8,49.6 116.9,49.6 116.9,8.6
  pour Top (isolate 0.254, rank 2): 0,0 0,18.4 -0.1,18.4 -0.1,90.5 0,90.5 0,104 140.5,104 140.5,90.5 140.6,90.5 140.6,18.5 140.5,18.5 140.5,0
  pour Bottom: 0,0 0,18.4 -0.1,18.4 -0.1,90.5 0,90.5 0,104 140.5,104 140.5,90.5 140.6,90.5 140.6,18.5 140.5,18.5 140.5,0
N$1
  Top 0.178: D2.A 3.5,71 4.7,69.8 4.7,67.9 U1.57
N$2
  Top 0.178: D1.A 5.8,68.1 6,67.9 U1.56
N$3
  Top 0.178: D2.C R3.2
N$4
  Top 0.178: D1.C R2.2
N$5
  pour Top (isolate 0.305): 73.78,13.79 73.78,19.5 78.48,19.5 78.48,13.79
N$6
  Top 0.178: R5.2 U1.7
N$7
  Top 0.178: R4.2 4.8,42.5 U1.4
N$8
  Top 0.178: C5.2 60.7,37.8 59.6,38.9 59.6,40.6 61,42 61.7,42 U2.3
N$11
  Top 0.178: C6.2 61.9,44.5 61.8,44.6 U2.5
N$12
  Top 0.178: C7.1 62.1,46.3 61.8,46 U2.6
N$15
  Top 0.178: C8.1 61.8,40.8 U2.2
N$17
  Top 0.178: U3.4 39.2,42.8 39.8,42.8 41.3,44.3 41.3,46.3 39.4,48.2 28.6,48.2 U1.25
N$18
  Top 0.178: U3.1 39.1,46.7 28.8,46.7 28.6,46.9 U1.24
N$19
  Top 0.178: U3.3 39.2,44.1 39.2,45.3 U3.2 39.1,45.4 37.6,45.4 34.7,42.5 U1.21
N$20
  Top 0.4: U3.7 44.5,45.3 45.2,45.3 47.5,43 R-T.1 47.5,38.4 41.2,32.1 41.2,16.9 J4.4
N$21
  Top 0.4: U3.6 44.5,44.1 45.5,44.1 46.7,42.9 46.7,42.3 46.5,42.1 R-T.2 46.4,38.8 34,26.4 34,14.7 36.5,12.2 38.1,12.2 39.8,13.9 39.8,14.3 J4.5
N$22
  Top 0.4: CSS.1 105.7,30.4 106.9,29.2 106.9,26.6 U-P1.14
N$23
  Top 0.406: U-P1.12 U-P1.13 107.9,26.1
  Top 1.1: 107.9,26.1 L1.1
N$24
  Top 0.25: RCOMP.2 102.4,26.7
  Top 0.4: RCOMP.2 RFB1.2 | 102.4,26.7 RFB2.1
  Top 0.406: RFB1.2 105.6,26.6 U-P1.16
N$25
  Top 0.4: CCOMP.1 RCOMP.1
N$26
  Top 0.25: REN1.1 109.4,28.7 108.9,28.2 108.9,26.6
  Top 0.254: REN1.1 REN2.2 | U-P1.11 108.9,26.6
N$27  (via drill 2.8)
  other vias: 4,9
N$28  (via drill 0.36)
  Top 0.178: v9.7,85.6 R.ACT.R.2 | v14.4,80.9 15,81.5 15.9,81.5 U4.15
  Bottom 0.178: v14.4,80.9 v9.7,85.6
N$29  (via drill 2.8)
  other vias: 4,100
N$30  (via drill 0.36)
  Top 0.178: v12.3,85.8 R.ACT.G.2 | v14.4,84.7 14.6,84.5 14.6,83.6 15.4,82.8 15.9,82.8 U4.14
  Bottom 0.178: v12.3,85.8 13.3,85.8 v14.4,84.7
N$31  (via drill 2.8)
  other vias: 136,100
N$32  (via drill 2.8)
  other vias: 136,9
N$33
  Top 0.178: R.ACT.B.1 7.9,90.7 7.8,90.8 LED-ACTION.1
N$34
  Top 0.178: R.ACT.R.1 9.7,90.6 9.5,90.8 LED-ACTION.2
N$35
  Top 0.178: R.ACT.G.1 11.6,90.5 11.3,90.8 LED-ACTION.3
N$36  (via drill 0.36)
  Top 0.178: v22.1,70.2 22.1,80.2 U4.1 | v26.7,60.5 27.5,59.7 28.5,59.7 U1.34
  Bottom 0.178: v22.1,70.2 22.1,65.1 v26.7,60.5
N$37  (via drill 0.36)
  Top 0.178: v20.5,80.9 21.1,81.5 22,81.5 U4.2 | v20.5,65.5 27.6,58.4 28.5,58.4 U1.33
  Bottom 0.178: v20.5,65.5 v20.5,80.9
N$38  (via drill 0.36)
  Top 0.178: R.ACT.B.2 v8.6,85.7 | v15,79.3 15.9,80.2 U4.16
  Bottom 0.178: v8.6,85.7 v15,79.3
N$39  (via drill 0.36)
  Top 0.178: v27.8,77.7 22.8,82.7 22.1,82.7 U4.3 | v26.7,58 27.5,57.2 28.5,57.2 U1.32
  Bottom 0.178: v27.8,77.7 27.8,59.1 v26.7,58
R1IN
  Top 0.178: U2.13 55.1,43.3 55.7,43.3 57.9,41.1 57.9,17.1 58.1,16.9 J2.4
R1OUT  (via drill 0.36)
  Top 0.178: v53.5,44.6 55,44.6 U2.12 | v30.4,62.8 29.8,63.4 28.6,63.4 U1.37
  Bottom 0.178: v53.5,44.6 48.6,44.6 v30.4,62.8
RESET  (via drill 0.36)
  Top 0.178: 14.6,73.1 R1.1 14.5,73.1 | 14.6,73.1 C2.1 | 14.6,73.1 14.6,68.2 14.9,67.9 U1.49 15,67.9 15,66.9 v15.9,66
  Bottom 0.178: v15.9,66 24.4,57.5 24.4,9.7 25.6,8.5 25.6,7.7 J1.2
RTCK
  Top 0.178: U1.16 20.1,42.5 20.1,12.4 21.9,10.6 21.9,8.9 23.1,7.7 J1.4
T1IN
  Top 0.178: 31.85,62.05 31.8,62.1 28.6,62.1 U1.36 | 31.85,62.05 47.9,46 55,46 U2.11 | DSP-3V3.2 40.6,82.6 40.6,82.3 37.9,79.6 37.3,79.6 31.9,74.2 31.9,62.1 31.85,62.05
T1OUT  (via drill 0.36)
  Top 0.178: v51.3,45.3 54.5,42.1 55,42.1 U2.14
  Bottom 0.178: v51.3,45.3 51.3,66.7 40.7,77.3 40.7,77.6 DSP-5V.2
TCK
  Top 0.178: U1.19 23.8,42.5 23.8,10.9 23.1,10.2 J1.3
TDI  (via drill 0.36)
  Top 0.178: v22.6,12.2 22.6,42.5 U1.18
  Bottom 0.178: v22.6,12.2 20.6,10.2 J1.5
TDO  (via drill 0.36)
  Top 0.178: v21.2,13.4 21.2,42.5 U1.17
  Bottom 0.178: v21.2,13.4 18,10.2 J1.7
TMS
  Top 0.178: U1.20 25.2,42.5 25.2,10.6 25.6,10.2 J1.1
V-PROT
  Top 0.25: 109.6,26.65 109.6,27.8 109.9,28.1 111.8,28.1 REN1.2 112.2,19.8 108.9,16.5 | CIN.1 108.8,18.1 108.9,18.2
  Top 0.254: 109.6,26.65 U-P1.10
  Top 0.406: U-P1.6 U-P1.5 | 108.9,20.6 109.5,20.6 U-P1.7
  Top 1.422: 108.9,20.6 108.9,18.2 108.9,16.5 107.2,14.9 104.26,14.9 U-P2.3
  Top 1.676: 108.9,20.6 U-P1.6
VBATT
  Top 1.27: J5.1 110.6,12.6 U-P2.4

### Text on the board
tPlace: 3v3 | GND | 3V3 | +5V | Codeshelf-0005.v1.r1
tNames: GND